# EAGLE design uDJV_board_1_v1.1 (EAGLE 9.3.1)

## Sheet 1 of 2
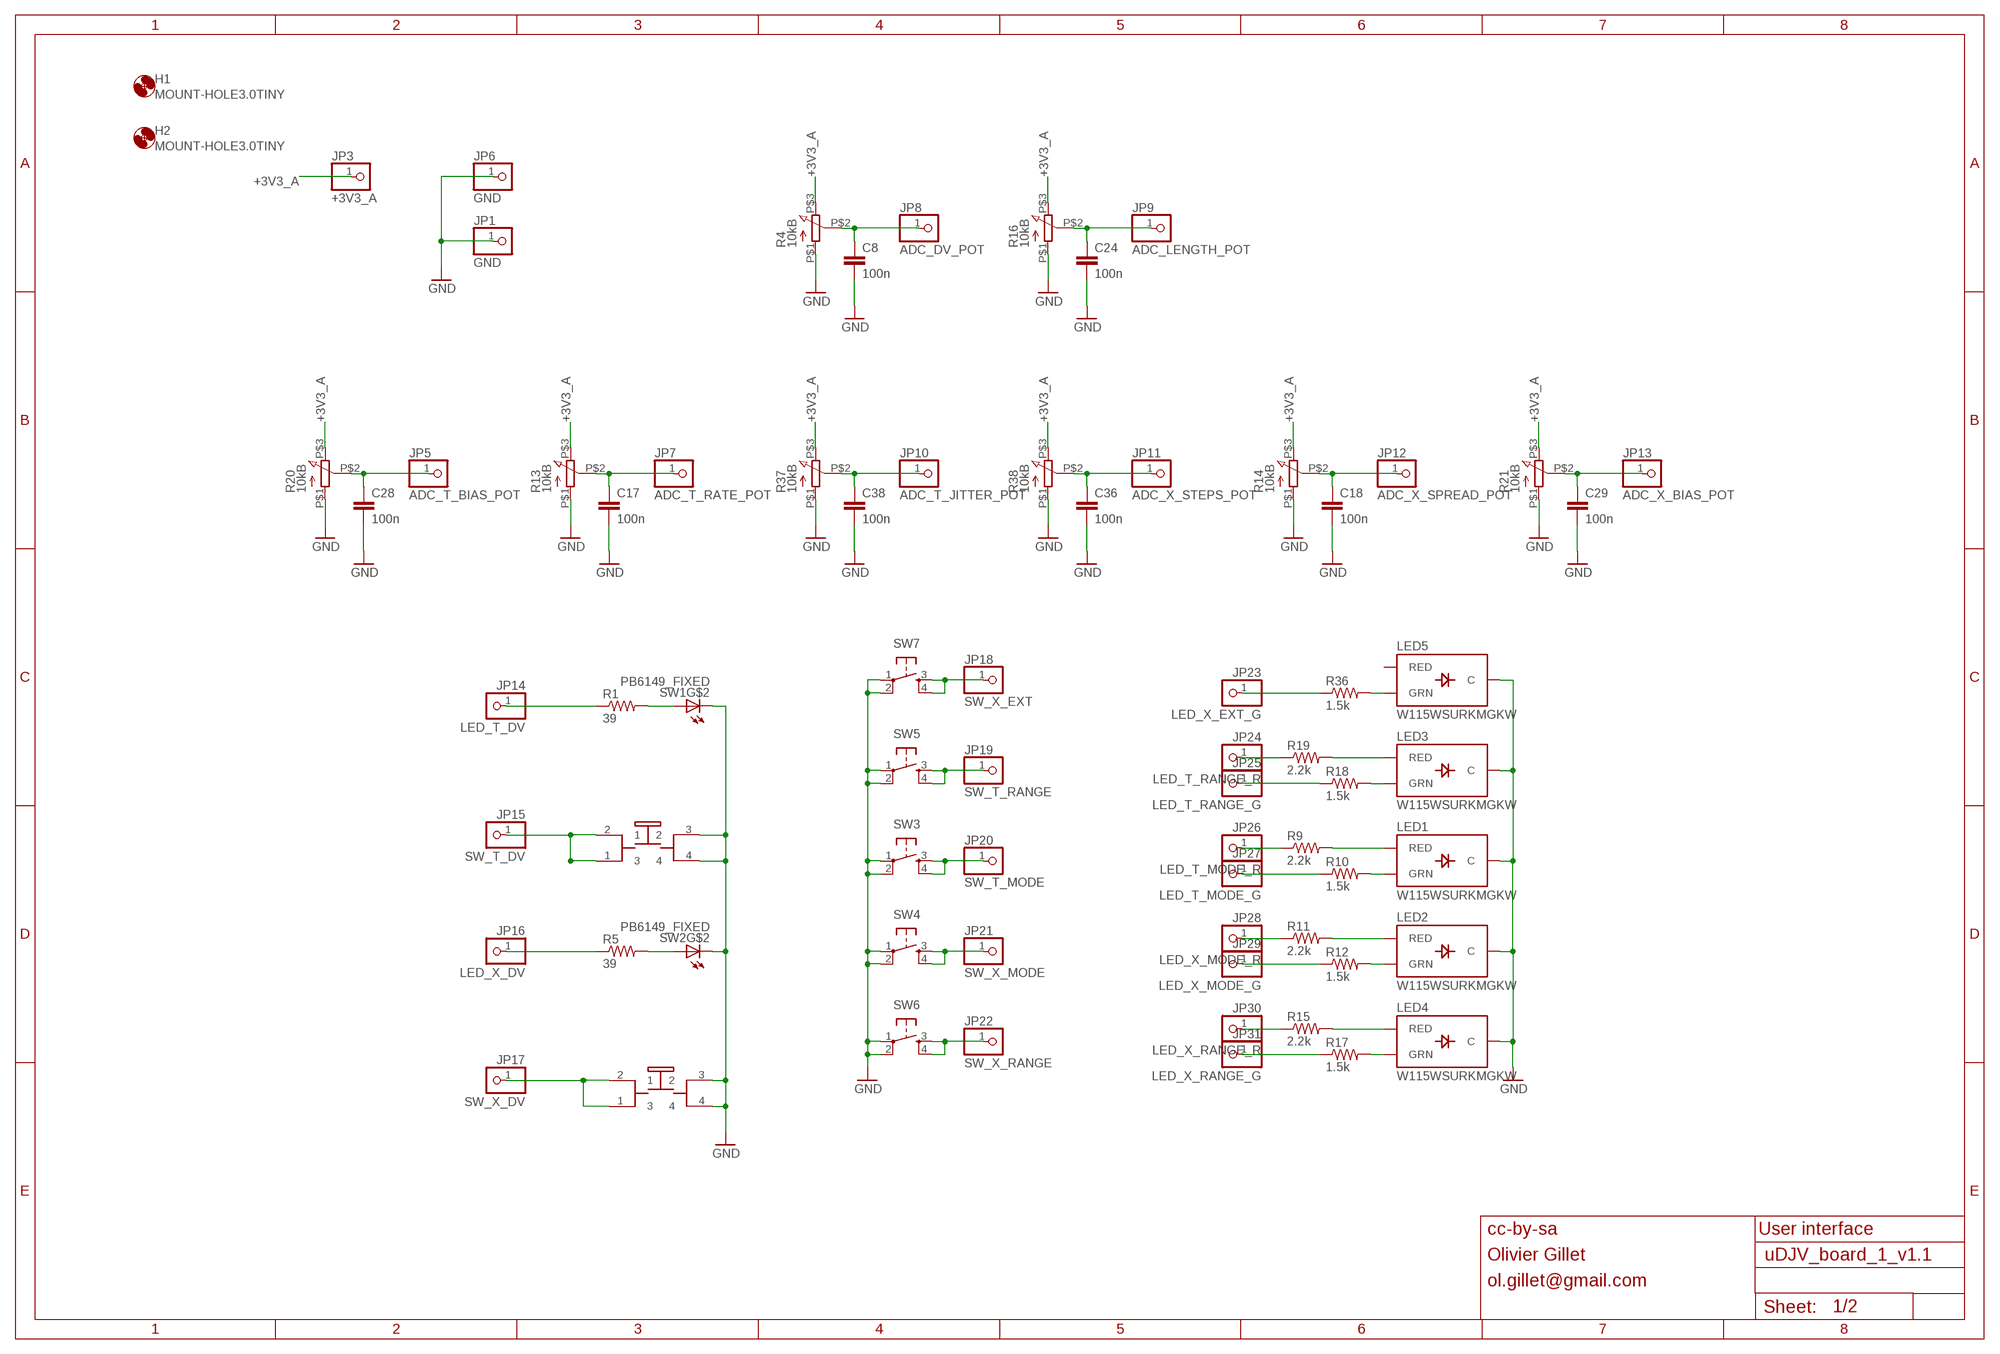
[diagram p0: schematic, sheet 1]

### Parts
C8  100n  PARTS_AMAN_CAPACITOR  [PARTS_AMAN_RESISTOR_0603]
C17  100n  PARTS_AMAN_CAPACITOR  [PARTS_AMAN_RESISTOR_0603]
C18  100n  PARTS_AMAN_CAPACITOR  [PARTS_AMAN_RESISTOR_0603]
C24  100n  PARTS_AMAN_CAPACITOR  [PARTS_AMAN_RESISTOR_0603]
C28  100n  PARTS_AMAN_CAPACITOR  [PARTS_AMAN_RESISTOR_0603]
C29  100n  PARTS_AMAN_CAPACITOR  [PARTS_AMAN_RESISTOR_0603]
C36  100n  PARTS_AMAN_CAPACITOR  [PARTS_AMAN_RESISTOR_0603]
C38  100n  PARTS_AMAN_CAPACITOR  [PARTS_AMAN_RESISTOR_0603]
H1  MOUNT-HOLE3.0TINY  [3,0TINY]
H2  MOUNT-HOLE3.0TINY  [3,0TINY]
JP1  GND  PARTS_AMAN_PINHD-1X1  [PARTS_AMAN_1X01]
JP3  +3V3_A  PARTS_AMAN_PINHD-1X1  [PARTS_AMAN_1X01]
JP5  ADC_T_BIAS_POT  PARTS_AMAN_PINHD-1X1  [PARTS_AMAN_1X01]
JP6  GND  PARTS_AMAN_PINHD-1X1  [PARTS_AMAN_1X01]
JP7  ADC_T_RATE_POT  PARTS_AMAN_PINHD-1X1  [PARTS_AMAN_1X01]
JP8  ADC_DV_POT  PARTS_AMAN_PINHD-1X1  [PARTS_AMAN_1X01]
JP9  ADC_LENGTH_POT  PARTS_AMAN_PINHD-1X1  [PARTS_AMAN_1X01]
JP10  ADC_T_JITTER_POT  PARTS_AMAN_PINHD-1X1  [PARTS_AMAN_1X01]
JP11  ADC_X_STEPS_POT  PARTS_AMAN_PINHD-1X1  [PARTS_AMAN_1X01]
JP12  ADC_X_SPREAD_POT  PARTS_AMAN_PINHD-1X1  [PARTS_AMAN_1X01]
JP13  ADC_X_BIAS_POT  PARTS_AMAN_PINHD-1X1  [PARTS_AMAN_1X01]
JP14  LED_T_DV  PARTS_AMAN_PINHD-1X1  [PARTS_AMAN_1X01]
JP15  SW_T_DV  PARTS_AMAN_PINHD-1X1  [PARTS_AMAN_1X01]
JP16  LED_X_DV  PARTS_AMAN_PINHD-1X1  [PARTS_AMAN_1X01]
JP17  SW_X_DV  PARTS_AMAN_PINHD-1X1  [PARTS_AMAN_1X01]
JP18  SW_X_EXT  PARTS_AMAN_PINHD-1X1  [PARTS_AMAN_1X01]
JP19  SW_T_RANGE  PARTS_AMAN_PINHD-1X1  [PARTS_AMAN_1X01]
JP20  SW_T_MODE  PARTS_AMAN_PINHD-1X1  [PARTS_AMAN_1X01]
JP21  SW_X_MODE  PARTS_AMAN_PINHD-1X1  [PARTS_AMAN_1X01]
JP22  SW_X_RANGE  PARTS_AMAN_PINHD-1X1  [PARTS_AMAN_1X01]
JP23  LED_X_EXT_G  PARTS_AMAN_PINHD-1X1  [PARTS_AMAN_1X01]
JP24  LED_T_RANGE_R  PARTS_AMAN_PINHD-1X1  [PARTS_AMAN_1X01]
JP25  LED_T_RANGE_G  PARTS_AMAN_PINHD-1X1  [PARTS_AMAN_1X01]
JP26  LED_T_MODE_R  PARTS_AMAN_PINHD-1X1  [PARTS_AMAN_1X01]
JP27  LED_T_MODE_G  PARTS_AMAN_PINHD-1X1  [PARTS_AMAN_1X01]
JP28  LED_X_MODE_R  PARTS_AMAN_PINHD-1X1  [PARTS_AMAN_1X01]
JP29  LED_X_MODE_G  PARTS_AMAN_PINHD-1X1  [PARTS_AMAN_1X01]
JP30  LED_X_RANGE_R  PARTS_AMAN_PINHD-1X1  [PARTS_AMAN_1X01]
JP31  LED_X_RANGE_G  PARTS_AMAN_PINHD-1X1  [PARTS_AMAN_1X01]
LED1  W115WSURKMGKW  LED-BICOLOR-THROUGHHOLE2.54  [LED-BICOLOR-THROUGHHOLE-2.54]
LED2  W115WSURKMGKW  LED-BICOLOR-THROUGHHOLE2.54  [LED-BICOLOR-THROUGHHOLE-2.54]
LED3  W115WSURKMGKW  LED-BICOLOR-THROUGHHOLE2.54  [LED-BICOLOR-THROUGHHOLE-2.54]
LED4  W115WSURKMGKW  LED-BICOLOR-THROUGHHOLE2.54  [LED-BICOLOR-THROUGHHOLE-2.54]
LED5  W115WSURKMGKW  LED-BICOLOR-THROUGHHOLE2.54  [LED-BICOLOR-THROUGHHOLE-2.54]
R1  39  PARTS_AMAN_RESISTOR  [PARTS_AMAN_RESISTOR_0603]
R4  10kB  Q-POT2  [Q-POT2]
R5  39  PARTS_AMAN_RESISTOR  [PARTS_AMAN_RESISTOR_0603]
R9  2.2k  PARTS_AMAN_RESISTOR  [PARTS_AMAN_RESISTOR_0603]
R10  1.5k  PARTS_AMAN_RESISTOR  [PARTS_AMAN_RESISTOR_0603]
R11  2.2k  PARTS_AMAN_RESISTOR  [PARTS_AMAN_RESISTOR_0603]
R12  1.5k  PARTS_AMAN_RESISTOR  [PARTS_AMAN_RESISTOR_0603]
R13  10kB  Q-POT2  [Q-POT2]
R14  10kB  Q-POT2  [Q-POT2]
R15  2.2k  PARTS_AMAN_RESISTOR  [PARTS_AMAN_RESISTOR_0603]
R16  10kB  Q-POT2  [Q-POT2]
R17  1.5k  PARTS_AMAN_RESISTOR  [PARTS_AMAN_RESISTOR_0603]
R18  1.5k  PARTS_AMAN_RESISTOR  [PARTS_AMAN_RESISTOR_0603]
R19  2.2k  PARTS_AMAN_RESISTOR  [PARTS_AMAN_RESISTOR_0603]
R20  10kB  Q-POT2  [Q-POT2]
R21  10kB  Q-POT2  [Q-POT2]
R36  1.5k  PARTS_AMAN_RESISTOR  [PARTS_AMAN_RESISTOR_0603]
R37  10kB  Q-POT2  [Q-POT2]
R38  10kB  Q-POT2  [Q-POT2]
SW1  PB6149_FIXED  [PB6149L]
SW2  PB6149_FIXED  [PB6149L]
SW3  TAC_SWITCHPTH  [TACTILE-PTH]
SW4  TAC_SWITCHPTH  [TACTILE-PTH]
SW5  TAC_SWITCHPTH  [TACTILE-PTH]
SW6  TAC_SWITCHPTH  [TACTILE-PTH]
SW7  TAC_SWITCHPTH  [TACTILE-PTH]

### Nets
+3V3_A: JP3.1 R4.P$3 R13.P$3 R14.P$3 R16.P$3 R20.P$3 R21.P$3 R37.P$3 R38.P$3
ADC_DV_POT: C8.1 JP8.1 R4.P$2
ADC_LENGTH_POT: C24.1 JP9.1 R16.P$2
ADC_T_BIAS_POT: C28.1 JP5.1 R20.P$2
ADC_T_JITTER_POT: C38.1 JP10.1 R37.P$2
ADC_T_RATE_POT: C17.1 JP7.1 R13.P$2
ADC_X_BIAS_POT: C29.1 JP13.1 R21.P$2
ADC_X_SPREAD_POT: C18.1 JP12.1 R14.P$2
ADC_X_STEPS_POT: C36.1 JP11.1 R38.P$2
GND: C8.2 C17.2 C18.2 C24.2 C28.2 C29.2 C36.2 C38.2 JP1.1 JP6.1 LED1.2(C) LED2.2(C) LED3.2(C) LED4.2(C) LED5.2(C) R4.P$1 R13.P$1 R14.P$1 R16.P$1 R20.P$1 R21.P$1 R37.P$1 R38.P$1 SW1.3 SW1.4 SW1.K(C) SW2.3 SW2.4 SW2.K(C) SW3.1 SW3.2 SW4.1 SW4.2 SW5.1 SW5.2 SW6.1 SW6.2 SW7.1 SW7.2 ; also sheet 2
LED_T_DV: JP14.1 R1.1
LED_X_DV: JP16.1 R5.1
N$1: R1.2 SW1.A
N$2: R5.2 SW2.A
N$9: LED3.3(RED) R19.2
N$12: LED3.1(GRN) R18.2
N$16: LED1.3(RED) R9.2
N$18: LED2.3(RED) R11.2
N$20: LED2.1(GRN) R12.2
N$21: LED4.3(RED) R15.2
N$22: LED1.1(GRN) R10.2
N$23: LED4.1(GRN) R17.2
N$42: LED5.1(GRN) R36.2
N$43: JP23.1 R36.1
N$55: JP24.1 R19.1
N$66: JP25.1 R18.1
N$69: JP26.1 R9.1
N$79: JP27.1 R10.1
N$80: JP28.1 R11.1
N$81: JP29.1 R12.1
N$82: JP30.1 R15.1
N$83: JP31.1 R17.1
SW_T_DV: JP15.1 SW1.1 SW1.2
SW_T_MODE: JP20.1 SW3.3 SW3.4
SW_T_RANGE: JP19.1 SW5.3 SW5.4
SW_X_DV: JP17.1 SW2.1 SW2.2
SW_X_EXT: JP18.1 SW7.3 SW7.4
SW_X_MODE: JP21.1 SW4.3 SW4.4
SW_X_RANGE: JP22.1 SW6.3 SW6.4
Unconnected: LED5.3(RED)

### Notes on the sheet
- cc-by-sa | User interface
- Olivier Gillet
- ol.gillet@gmail.com

## Sheet 2 of 2
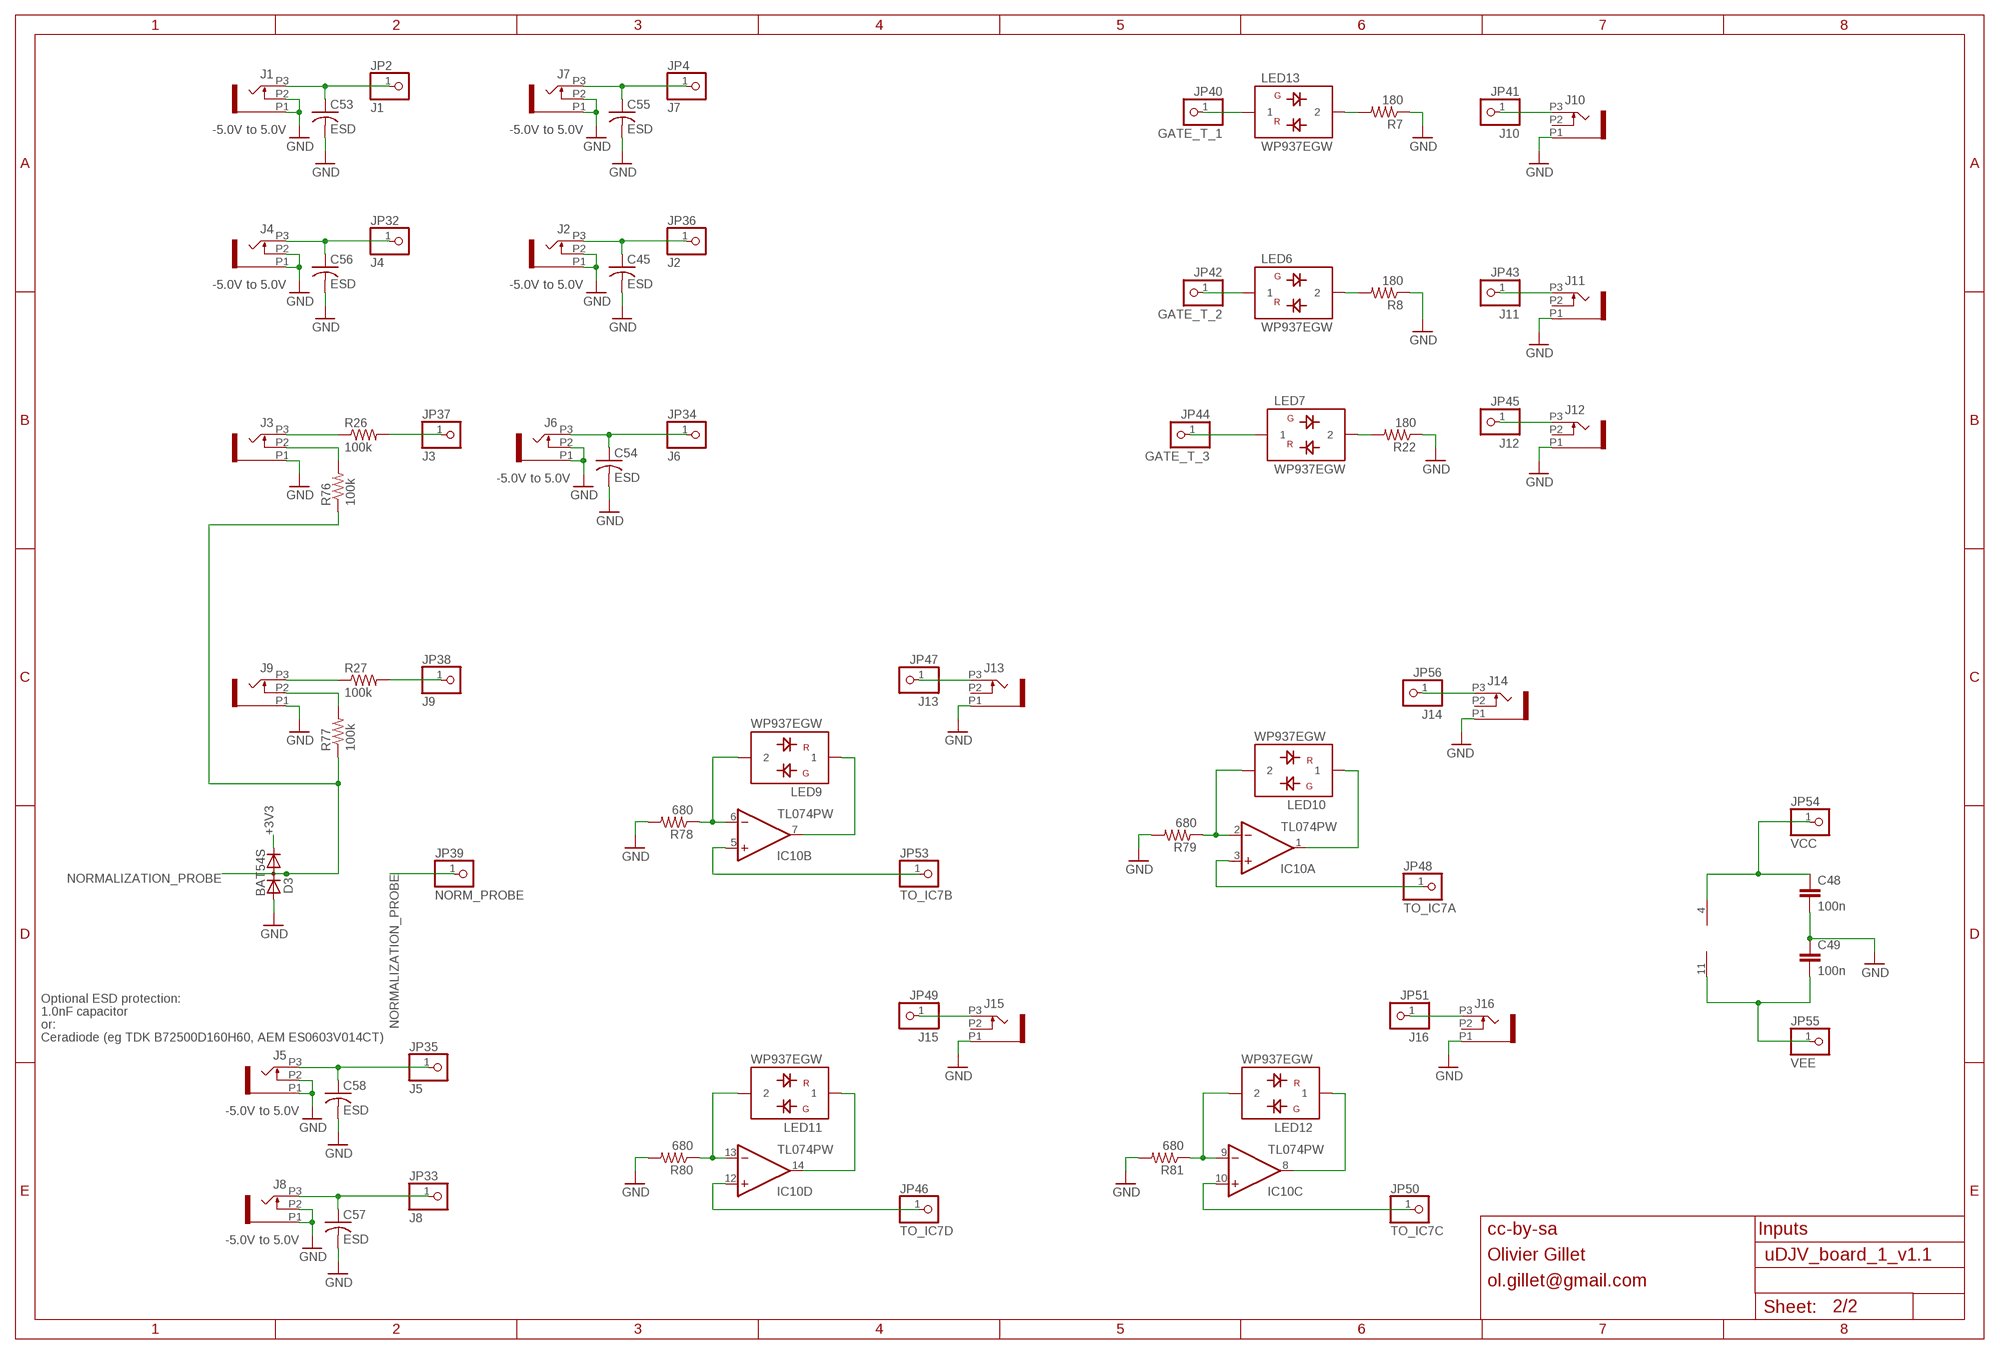
[diagram p1: schematic, sheet 2]

### Parts
C45  ESD  C-USC0603  [C0603]
C48  100n  PARTS_AMAN_CAPACITOR  [PARTS_AMAN_RESISTOR_0603]
C49  100n  PARTS_AMAN_CAPACITOR  [PARTS_AMAN_RESISTOR_0603]
C53  ESD  C-USC0603  [C0603]
C54  ESD  C-USC0603  [C0603]
C55  ESD  C-USC0603  [C0603]
C56  ESD  C-USC0603  [C0603]
C57  ESD  C-USC0603  [C0603]
C58  ESD  C-USC0603  [C0603]
D3  BAT54S  DIODE_2CACA-SOT23  [SOT23]
IC10  TL074PW  [TSSOP14_065]
J1  PJ301_THONKICONN6  [WQP_PJ_301M6]
J2  PJ301_THONKICONN6  [WQP_PJ_301M6]
J3  PJ301_THONKICONN6  [WQP_PJ_301M6]
J4  PJ301_THONKICONN6  [WQP_PJ_301M6]
J5  PJ301_THONKICONN6  [WQP_PJ_301M6]
J6  PJ301_THONKICONN6  [WQP_PJ_301M6]
J7  PJ301_THONKICONN6  [WQP_PJ_301M6]
J8  PJ301_THONKICONN6  [WQP_PJ_301M6]
J9  PJ301_THONKICONN6  [WQP_PJ_301M6]
J10  PJ301_THONKICONN6  [WQP_PJ_301M6]
J11  PJ301_THONKICONN6  [WQP_PJ_301M6]
J12  PJ301_THONKICONN6  [WQP_PJ_301M6]
J13  PJ301_THONKICONN6  [WQP_PJ_301M6]
J14  PJ301_THONKICONN6  [WQP_PJ_301M6]
J15  PJ301_THONKICONN6  [WQP_PJ_301M6]
J16  PJ301_THONKICONN6  [WQP_PJ_301M6]
JP2  J1  PARTS_AMAN_PINHD-1X1  [PARTS_AMAN_1X01]
JP4  J7  PARTS_AMAN_PINHD-1X1  [PARTS_AMAN_1X01]
JP32  J4  PARTS_AMAN_PINHD-1X1  [PARTS_AMAN_1X01]
JP33  J8  PARTS_AMAN_PINHD-1X1  [PARTS_AMAN_1X01]
JP34  J6  PARTS_AMAN_PINHD-1X1  [PARTS_AMAN_1X01]
JP35  J5  PARTS_AMAN_PINHD-1X1  [PARTS_AMAN_1X01]
JP36  J2  PARTS_AMAN_PINHD-1X1  [PARTS_AMAN_1X01]
JP37  J3  PARTS_AMAN_PINHD-1X1  [PARTS_AMAN_1X01]
JP38  J9  PARTS_AMAN_PINHD-1X1  [PARTS_AMAN_1X01]
JP39  NORM_PROBE  PARTS_AMAN_PINHD-1X1  [PARTS_AMAN_1X01]
JP40  GATE_T_1  PARTS_AMAN_PINHD-1X1  [PARTS_AMAN_1X01]
JP41  J10  PARTS_AMAN_PINHD-1X1  [PARTS_AMAN_1X01]
JP42  GATE_T_2  PARTS_AMAN_PINHD-1X1  [PARTS_AMAN_1X01]
JP43  J11  PARTS_AMAN_PINHD-1X1  [PARTS_AMAN_1X01]
JP44  GATE_T_3  PARTS_AMAN_PINHD-1X1  [PARTS_AMAN_1X01]
JP45  J12  PARTS_AMAN_PINHD-1X1  [PARTS_AMAN_1X01]
JP46  TO_IC7D  PARTS_AMAN_PINHD-1X1  [PARTS_AMAN_1X01]
JP47  J13  PARTS_AMAN_PINHD-1X1  [PARTS_AMAN_1X01]
JP48  TO_IC7A  PARTS_AMAN_PINHD-1X1  [PARTS_AMAN_1X01]
JP49  J15  PARTS_AMAN_PINHD-1X1  [PARTS_AMAN_1X01]
JP50  TO_IC7C  PARTS_AMAN_PINHD-1X1  [PARTS_AMAN_1X01]
JP51  J16  PARTS_AMAN_PINHD-1X1  [PARTS_AMAN_1X01]
JP53  TO_IC7B  PARTS_AMAN_PINHD-1X1  [PARTS_AMAN_1X01]
JP54  VCC  PARTS_AMAN_PINHD-1X1  [PARTS_AMAN_1X01]
JP55  VEE  PARTS_AMAN_PINHD-1X1  [PARTS_AMAN_1X01]
JP56  J14  PARTS_AMAN_PINHD-1X1  [PARTS_AMAN_1X01]
LED6  WP937EGW  LED-BICOLOR-SHARED-THROUGHHOLE  [LED3MM]
LED7  WP937EGW  LED-BICOLOR-SHARED-THROUGHHOLE  [LED3MM]
LED9  WP937EGW  LED-BICOLOR-SHARED-THROUGHHOLE  [LED3MM]
LED10  WP937EGW  LED-BICOLOR-SHARED-THROUGHHOLE  [LED3MM]
LED11  WP937EGW  LED-BICOLOR-SHARED-THROUGHHOLE  [LED3MM]
LED12  WP937EGW  LED-BICOLOR-SHARED-THROUGHHOLE  [LED3MM]
LED13  WP937EGW  LED-BICOLOR-SHARED-THROUGHHOLE  [LED3MM]
R7  180  PARTS_AMAN_RESISTOR  [PARTS_AMAN_RESISTOR_0603]
R8  180  PARTS_AMAN_RESISTOR  [PARTS_AMAN_RESISTOR_0603]
R22  180  PARTS_AMAN_RESISTOR  [PARTS_AMAN_RESISTOR_0603]
R26  100k  PARTS_AMAN_RESISTOR  [PARTS_AMAN_RESISTOR_0603]
R27  100k  PARTS_AMAN_RESISTOR  [PARTS_AMAN_RESISTOR_0603]
R76  100k  PARTS_AMAN_RESISTOR  [PARTS_AMAN_RESISTOR_0603]
R77  100k  PARTS_AMAN_RESISTOR  [PARTS_AMAN_RESISTOR_0603]
R78  680  PARTS_AMAN_RESISTOR  [PARTS_AMAN_RESISTOR_0603]
R79  680  PARTS_AMAN_RESISTOR  [PARTS_AMAN_RESISTOR_0603]
R80  680  PARTS_AMAN_RESISTOR  [PARTS_AMAN_RESISTOR_0603]
R81  680  PARTS_AMAN_RESISTOR  [PARTS_AMAN_RESISTOR_0603]

### Nets
+3V3: D3.2(C)
GATE_T_2: JP42.1 LED6.1
GND: C45.2 C48.2 C49.1 C53.2 C54.2 C55.2 C56.2 C57.2 C58.2 D3.1(A) J1.P1 J1.P2 J2.P1 J2.P2 J3.P1 J4.P1 J4.P2 J5.P1 J5.P2 J6.P1 J6.P2 J7.P1 J7.P2 J8.P1 J8.P2 J9.P1 J10.P1 J11.P1 J12.P1 J13.P1 J14.P1 J15.P1 J16.P1 R7.1 R8.1 R22.1 R78.2 R79.2 R80.2 R81.2 ; also sheet 1
MORPH_IN: C53.1 J1.P3 JP2.1
MORPH_IN1: C55.1 J7.P3 JP4.1
MORPH_IN3: C56.1 J4.P3 JP32.1
MORPH_IN4: C57.1 J8.P3 JP33.1
MORPH_IN5: C54.1 J6.P3 JP34.1
MORPH_IN6: C58.1 J5.P3 JP35.1
MORPH_IN7: C45.1 J2.P3 JP36.1
N$3: C49.2 IC10.11(P:V-) JP55.1
N$4: JP37.1 R26.2
N$5: JP38.1 R27.2
N$6: JP40.1 LED13.1
N$7: J10.P3 JP41.1
N$8: J12.P3 JP45.1
N$10: LED13.2 R7.2
N$11: J11.P3 JP43.1
N$13: J16.P3 JP51.1
N$14: LED6.2 R8.2
N$15: LED7.2 R22.2
N$19: JP44.1 LED7.1
N$24: C48.1 IC10.4(P:V+) JP54.1
N$36: J9.P3 R27.1
N$45: IC10.5(B:+IN) JP53.1
N$46: J9.P2 R77.2
N$47: J3.P2 R76.2
N$49: J15.P3 JP49.1
N$53: J13.P3 JP47.1
N$57: J3.P3 R26.1
N$63: J14.P3 JP56.1
N$67: IC10.6(B:-IN) LED9.2 R78.1
N$68: IC10.7(B:OUT) LED9.1
N$70: IC10.3(A:+IN) JP48.1
N$71: IC10.2(A:-IN) LED10.2 R79.1
N$72: IC10.1(A:OUT) LED10.1
N$73: IC10.12(D:+IN) JP46.1
N$74: IC10.13(D:-IN) LED11.2 R80.1
N$75: IC10.14(D:OUT) LED11.1
N$76: IC10.10(C:+IN) JP50.1
N$77: IC10.9(C:-IN) LED12.2 R81.1
N$78: IC10.8(C:OUT) LED12.1
NORMALIZATION_PROBE: D3.3(AC) JP39.1 R76.1 R77.1
Unconnected: J10.P2 J11.P2 J12.P2 J13.P2 J14.P2 J15.P2 J16.P2

### Notes on the sheet
- -5.0V to 5.0V | -5.0V to 5.0V
- -5.0V to 5.0V | -5.0V to 5.0V
- -5.0V to 5.0V
- Optional ESD protection:
- 1.0nF capacitor
- or:
- Ceradiode (eg TDK B72500D160H60, AEM ES0603V014CT)
- -5.0V to 5.0V
- -5.0V to 5.0V | cc-by-sa | Inputs
- Olivier Gillet
- ol.gillet@gmail.com

## Library data of the parts
C8 C17 C18 C24 C28 C29 C36 C38 C48 C49 = atom_v1_1_board_2:PARTS_AMAN_CAPACITOR
C45 C53-C58 = rcl:C-US: CAPACITOR, American symbol
D3 = diode:DIODE_2CACA-: 2 Diodes - Cathode-Anode|Cathode-Anode
H1 H2 = og-holes:MOUNT-HOLE: MOUNTING HOLE with drill center marker
IC10 = og-linear:TL074: OP AMP
J1-J16 = og-pj301:PJ301_THONKICONN
JP1-JP51 JP53-JP56 = atom_v1_1_board_2:PARTS_AMAN_PINHD-1X1: PIN HEADER
LED1-LED5 = og-leds:LED-BICOLOR-THROUGHHOLE
LED6 LED7 LED9-LED13 = og-leds:LED-BICOLOR-SHARED-THROUGHHOLE
R1 R5 R7-R12 R15 R17-R19 R22 R26 R27 R36 R76-R81 = atom_v1_1_board_2:PARTS_AMAN_RESISTOR
R4 R13 R14 R16 R20 R21 R37 R38 = uClouds_002:Q-POT2
SW1 SW2 = uClouds_002:PB6149_FIXED
SW3-SW7 = SparkFun:TAC_SWITCH: Momentary Switch Button commonly used for reset or general input. Spark Fun Electronics SKU : COM-00097

## Board
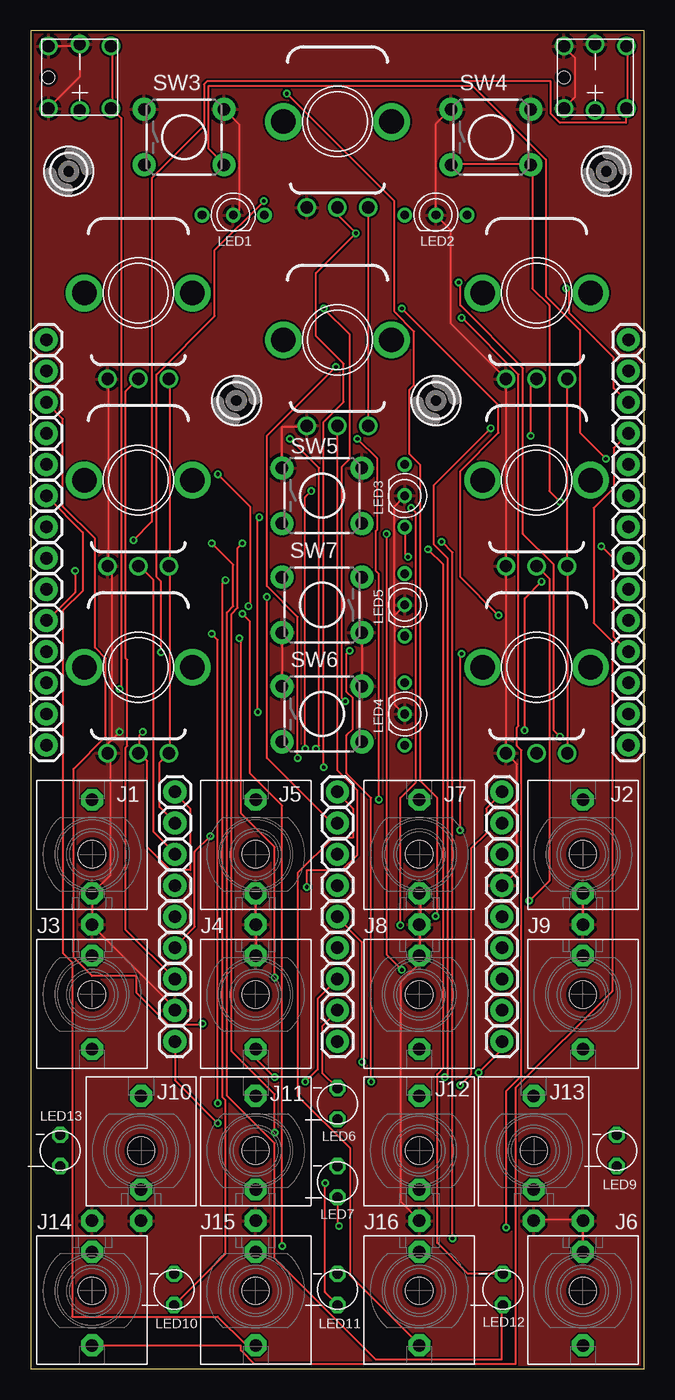
[diagram p2: board, top side]
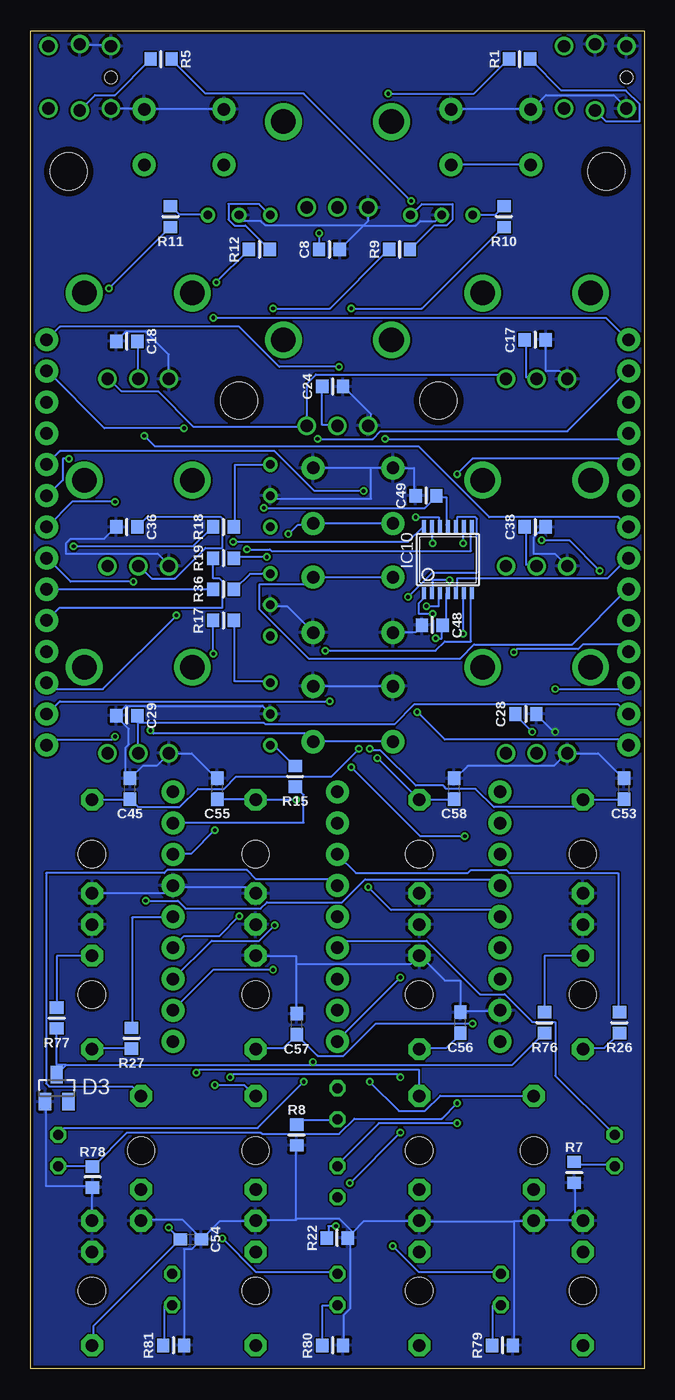
[diagram p3: board, bottom side, seen from below]

Size 50 x 109 mm. Coordinates in mm from the lower left corner, seen from the top.
Outline: 0,0 50,0 50,109 0,109 0,0
Copper layers (1*16): Top 0.035mm / dielectric 1.5mm / Bottom 0.035mm
Design rules "dirt_cheap_dirty_boards.v1.1": minimum track width 6mil, minimum drill 12mil, track to track 6mil, track to pad 6mil, pad to pad 6mil, via to via 6mil, smd to smd 0mil, copper to edge 10mil, drill to drill 10mil, minimum pad ring 10mil, minimum via ring 6mil, stop-mask expansion 2mil, vias tented up to drill 25mil, thermal gap 10mil

### Footprints (pad centres in the part's own frame; a part is rotated, then mirrored left to right if it is on the bottom)
PARTS_AMAN_RESISTOR_0603 = smd 1 x 1.1: 1 -0.85,0; 2 0.85,0
C0603 = smd 1.1 x 1: 1 -0.85,0; 2 0.85,0
SOT23 = smd 1 x 1.4: 1 -0.95,-1.1; 2 0.95,-1.1; 3 0,1.1
3,0TINY = hole 3: 0,0
TSSOP14_065 = smd 0.305 x 0.991: 1 -1.95,-2.718; 2 -1.3,-2.718; 3 -0.65,-2.718; 4 0,-2.718; 5 0.65,-2.718; 6 1.3,-2.718; 7 1.95,-2.718; 8 1.95,2.718; 9 1.3,2.718; 10 0.65,2.718; 11 0,2.718; 12 -0.65,2.718; 13 -1.3,2.718; 14 -1.95,2.718
WQP_PJ_301M6 = drill 1.016 pad 1.778 octagon: P1 0,-5.715; P2 0,-3.175; P3 0,4.445 | hole 2.2: 0,0
PARTS_AMAN_1X01 = drill 1.016 pad 1.88: 1 0,0
LED-BICOLOR-THROUGHHOLE-2.54 = drill 0.7: 1 -2.54,0; 2 0,0; 3 2.54,0
LED3MM = drill 0.813 octagon: 1 -1.27,0; 2 1.27,0
Q-POT2 = drill 1 pad 1.5: P$1 -2.5,-7; P$2 0,-7; P$3 2.5,-7 | drill 2 pad 2.5: P$4 -4.4,0; P$5 4.4,0
PB6149L = drill 1: 1 2.54,-2.54; 2 2.54,2.54; 3 -2.54,-2.54; 4 -2.54,2.54; A 0,-2.7; K 0,2.7 | hole 1: -2.54,0
TACTILE-PTH = drill 1.016 pad 1.88: 1 -3.251,2.261; 2 3.251,2.261; 3 -3.251,-2.261; 4 3.251,-2.261

### Placement (x,y rotation side)
C8  25.65,91.19 0 bottom
C17  8.89,83.82 0 bottom
C18  42.16,83.69 180 bottom
C24  25.4,80.01 0 bottom
C28  9.65,53.34 0 bottom
C29  42.16,53.21 180 bottom
C36  42.16,68.58 180 bottom
C38  8.89,68.58 0 bottom
C45  41.91,47.24 90 bottom
C48  17.27,60.58 180 bottom
C49  17.78,71.12 0 bottom
C53  1.65,47.24 90 bottom
C54  36.96,10.54 0 bottom
C55  34.8,47.24 90 bottom
C56  14.99,28.19 90 bottom
C57  28.32,28.07 90 bottom
C58  15.49,47.24 90 bottom
D3  47.88,22.86 0 bottom
H1  16.76,78.87 0 top
H2  33.02,78.87 0 top
H3  MOUNT-HOLE3.0TINY  [3,0TINY]  3.1,97.54 0 top
H4  MOUNT-HOLE3.0TINY  [3,0TINY]  46.9,97.54 0 top
IC10  16,65.91 0 bottom
J1  5,41.91 0 top
J2  45,41.91 0 top
J3  5,30.48 180 top
J4  18.33,30.48 180 top
J5  18.33,41.91 0 top
J6  45,6.35 180 top
J7  31.67,41.91 0 top
J8  31.67,30.48 180 top
J9  45,30.48 180 top
J10  9,17.78 0 top
J11  18.33,17.78 0 top
J12  31.67,17.78 0 top
J13  41,17.78 0 top
J14  5,6.35 180 top
J15  18.33,6.35 180 top
J16  31.67,6.35 180 top
JP1  38.4,39.37 0 top
JP2  48.7,73.66 0 top
JP3  11.75,44.45 0 top
JP4  1.27,81.28 0 top
JP5  11.75,46.99 0 top
JP6  11.75,29.21 0 top
JP7  11.75,31.75 0 top
JP8  11.75,34.29 0 top
JP9  11.75,36.83 0 top
JP10  11.75,41.91 0 top
JP11  11.75,39.37 0 top
JP12  1.27,68.58 0 top
JP13  1.27,53.34 0 top
JP14  38.4,34.29 0 top
JP15  1.27,55.88 0 top
JP16  1.27,58.42 0 top
JP17  1.27,60.96 0 top
JP18  1.27,63.5 0 top
JP19  38.4,29.21 0 top
JP20  48.7,71.12 0 top
JP21  48.7,68.58 0 top
JP22  48.7,66.04 0 top
JP23  48.7,63.5 0 top
JP24  48.7,60.96 0 top
JP25  48.7,58.42 0 top
JP26  48.7,55.88 0 top
JP27  48.7,53.34 0 top
JP28  48.7,78.74 0 top
JP29  48.7,50.8 0 top
JP30  38.4,44.45 0 top
JP31  38.4,41.91 0 top
JP32  48.7,81.28 0 top
JP33  1.27,78.74 0 top
JP34  1.27,83.82 0 top
JP35  48.7,83.82 0 top
JP36  1.27,76.2 0 top
JP37  25,41.91 0 top
JP38  38.4,36.83 0 top
JP39  25,36.83 0 top
JP40  25,34.29 0 top
JP41  25,31.75 0 top
JP42  25,29.21 0 top
JP43  38.4,26.67 0 top
JP44  11.75,26.67 0 top
JP45  38.4,46.99 0 top
JP46  1.27,50.8 0 top
JP47  25,39.37 0 top
JP48  1.27,73.66 0 top
JP49  1.27,71.12 0 top
JP50  25,44.45 0 top
JP51  25,46.99 0 top
JP53  1.27,66.04 0 top
JP54  25,26.67 0 top
JP55  38.4,31.75 0 top
JP56  48.7,76.2 0 top
LED1  16.51,93.98 0 top
LED2  33.02,93.98 0 top
LED3  30.48,71.12 270 top
LED4  30.48,53.34 270 top
LED5  30.48,62.23 270 top
LED6  25,21.59 270 top
LED7  25,15.24 270 top
LED9  47.75,17.78 270 top
LED10  11.68,6.46 270 top
LED11  25,6.46 270 top
LED12  38.48,6.46 270 top
LED13  2.41,17.78 270 top
R1  10.16,106.68 0 bottom
R4  25,101.6 0 top
R5  39.37,106.68 180 bottom
R7  5.71,16 90 bottom
R8  28.32,19.05 90 bottom
R9  19.94,91.19 0 bottom
R10  11.43,93.85 90 bottom
R11  38.61,93.85 90 bottom
R12  31.37,91.19 0 bottom
R13  8.77,87.63 0 top
R14  41.23,87.63 0 top
R15  28.45,48.26 90 bottom
R16  25,83.82 0 top
R17  34.29,60.96 0 bottom
R18  34.29,68.58 0 bottom
R19  34.29,66.04 0 bottom
R20  8.77,57.15 0 top
R21  41.23,57.15 0 top
R22  25.02,10.67 180 bottom
R26  2.03,28.19 90 bottom
R27  41.78,26.92 90 bottom
R36  34.29,63.5 0 bottom
R37  8.77,72.39 0 top
R38  41.23,72.39 0 top
R76  8.13,28.19 90 bottom
R77  47.88,28.57 90 bottom
R78  44.96,15.62 270 bottom
R79  11.56,1.91 0 bottom
R80  25.4,1.91 0 bottom
R81  38.35,1.91 0 bottom
SW1  4,105.2 0 top
SW2  46,105.2 0 top
SW3  12.5,100.33 0 top
SW4  37.5,100.33 0 top
SW5  23.73,71.12 0 top
SW6  23.73,53.34 0 top
SW7  23.73,62.23 180 top

### Tracks (layer width: path | path; a pad name or v marks a point on that pad's centre or on a via)
+3V3_A
  Top 0.152: JP3.1 11.75,44.5 10.5,45.75 10.5,49.38 11.25,50.12 R20.P$3 11.38,50.25 11.38,65.38 R37.P$3 11.38,65.5 11.38,80.62 R13.P$3 | R4.P$3 R16.P$3 | R21.P$3 43.75,50.25 43.75,65.38 R38.P$3 43.75,65.5 43.75,80.62 R14.P$3
  Bottom 0.152: R14.P$3 43.62,80.62 42.62,79.62 39.62,79.62 36.75,76.75 27.5,76.75 R16.P$3 27.5,80.25 26.75,81 11.62,81 11.38,80.75 R13.P$3
ADC_DV_POT  (via drill 0.3)
  Top 0.152: R4.P$2 25,94 v26.5,92.5 23.25,89.25 23.25,84.12 25.5,81.88 25.5,78.75 23.88,77.12 v23.88,49 | v14.62,43.38 13.38,42.12 13.38,36 11.75,34.38 JP8.1
  Bottom 0.152: v26.5,92.5 26.5,91.25 C8.1 | v23.88,49 18.25,43.38 v14.62,43.38
ADC_LENGTH_POT  (via drill 0.3)
  Top 0.152: R16.P$2 25,48.75 26.62,47.12 26.62,41.88 25.38,40.62 22.5,40.62 v22.5,39.25
  Bottom 0.152: C24.1 26.25,76.88 25,76.88 R16.P$2 | v22.5,39.25 20.62,37.38 12.25,37.38 11.75,36.88 JP9.1
ADC_T_BIAS_POT  (via drill 0.3)
  Top 0.152: v9.12,51.88 8.88,51.62 8.88,50.25 R20.P$2 8.88,50.12 9.5,49.5 9.5,42.5 11.38,40.62 13,40.62 13,45.62 11.75,46.88 JP5.1
  Bottom 0.152: v9.12,51.88 10.5,53.25 C28.1
ADC_T_JITTER_POT
  Top 0.152: R37.P$2 8.88,65.38 10,64.25 10,43.75 11.75,42 JP10.1
  Bottom 0.152: C38.1 9.62,68.5 9.62,65.5 8.88,65.5 R37.P$2
ADC_T_RATE_POT
  Top 0.152: JP7.1 7.75,35.75 7.75,50.62 7.88,50.75 7.88,57.75 7.75,57.88 7.75,79.62 8.75,80.62 R13.P$2
  Bottom 0.152: C17.1 9.62,83.75 9.62,80.75 8.88,80.75 R13.P$2
ADC_X_BIAS_POT
  Bottom 0.152: 41.25,52.62 41.25,50.25 R21.P$2 | 41.25,52.62 41.25,53.12 C29.1 | 41.25,52.62 31,52.62 30.88,52.5 20.38,52.5 18.75,54.12 2.12,54.12 1.38,53.38 JP13.1
ADC_X_SPREAD_POT  (via drill 0.3)
  Top 0.152: v40.75,76 40.75,80.25 41.12,80.62 R14.P$2
  Bottom 0.152: C18.1 41.25,83.62 41.25,80.75 R14.P$2 | v40.75,76 39.88,75.12 18.38,75.12 12.62,69.38 2.12,69.38 1.38,68.62 JP12.1
ADC_X_STEPS_POT  (via drill 0.3)
  Top 0.152: v40.62,38.12 42.25,39.75 42.25,64.38 41.25,65.38 R38.P$2
  Bottom 0.152: C36.1 41.25,68.62 40.5,69.38 34.5,69.38 34.38,69.25 34.38,66.88 35.75,66.88 38.25,64.38 40.12,64.38 41.12,65.38 R38.P$2 | v40.62,38.12 38,38.12 37.38,37.5 31.25,37.5 30.75,38 24.62,38 22.75,39.88 12.25,39.88 JP11.1
GATE_T_2
  Top 0.152: LED6.1 25,22.88 23.75,24.12 23.75,27.88 25,29.12 JP42.1
GND  (via drill 0.3)
  Top 0.152: R13.P$1 6.38,80.62 6.38,65.5 R37.P$1 6.38,65.38 6.62,65.12 6.62,51.25 | 6.62,51.25 6.38,51 6.38,50.25 R20.P$1 6.38,50.12 6.5,50 6.5,40.25 5,38.75 J1.P2 5,36.25 J3.P1 5,36.12 11.75,29.38 JP6.1 | 6.62,51.25 v7.25,51.88 | J4.P2 18.38,33.75 18.38,36.12 J4.P1 18.38,36.25 18.38,38.62 J5.P2 | J13.P1 41,12.12 44.88,12.12 J6.P1 45,12 45,9.62 J6.P2 | 18.38,12.12 J15.P1 | 31.75,12.12 J16.P1 31.62,12.12 30.12,13.62 30.12,31.5 31.62,33 31.62,33.62 J8.P2 31.75,33.75 31.75,36.12 J8.P1 31.75,36.25 31.75,38.62 J7.P2 | SW4.1 34.12,102.5 33,101.38 33,94 LED2.2 34.25,92.75 34.25,85.12 38.62,80.75 R14.P$1 38.75,80.62 38.75,65.5 R38.P$1 38.75,65.38 38.75,50.25 R21.P$1 38.75,50.12 39.62,49.25 39.62,40.5 38.5,39.38 JP1.1 | SW2.4 43.5,107.62 44.38,106.75 44.38,103.62 43.5,102.75 SW2.3 | 4,107.75 SW1.K 4,107.88 | 4,107.75 4,105.25 1.5,102.75 SW1.3 | 4,107.75 1.5,107.75 SW1.4 | LED1.2 16.62,94 17,94.38 17,101.38 15.88,102.5 SW3.2 | R16.P$1 22.5,76.75 20.5,76.75 20.5,73.5 SW5.1 | SW6.1 20.5,55.62 20.5,59.88 SW7.2 | SW6.2 27,55.62 27,59.88 SW7.1 | 29.62,61.38 29.62,54.12 30.38,53.38 LED4.2 | LED5.2 29.62,61.38 | 29.62,61.38 29.62,70.25 30.38,71 LED3.2 | J9.P1 45,36.25 45,38.62 J2.P2
  Bottom 0.152: C17.2 8,83.75 8,81.25 6.88,81.25 6.38,80.75 R13.P$1 | C38.2 8.12,68.5 8.5,68.12 8.62,68.12 9,67.75 9,66.38 7.25,66.38 6.38,65.5 R37.P$1 | C53.2 1.75,48.12 3.75,50.12 6.25,50.12 R20.P$1 6.38,50.12 7.38,49.12 14.38,49.12 15.38,48.12 C58.2 | v7.25,51.88 7.38,51.88 8.75,53.25 C28.2 | JP6.1 11.75,29.12 14.88,29.12 C56.2 15,29.12 15,31.62 16.25,31.62 18.25,33.62 J4.P2 18.38,33.62 19,33 28.38,33 | J6.P1 45,12.12 45,14.75 R78.2 45,14.88 48.75,14.88 48.75,21.75 D3.1 | 5.62,12.12 5.62,15.12 R7.1 | 5.62,12.12 5,12.12 J14.P1 5.62,12.12 | 10.62,12 10.62,2 R79.2 | 10.62,12 9,12 J10.P1 9,12.12 5.62,12.12 | 23.75,11.12 22.88,12 18.38,12 J15.P1 18.25,12 10.62,12 | 23.75,11.12 24.12,10.75 R22.1 | R80.2 24.5,2 24.5,4.38 24,4.88 24,10.62 24.12,10.62 R22.1 | 28.38,12.25 28.38,12.12 31.62,12.12 J16.P1 31.75,12 34.62,12 36,10.62 C54.2 | 28.38,12.25 28.38,18.12 R8.1 | R81.2 37.5,2 37.5,9.75 36.88,9.75 36.12,10.5 C54.2 | 23.75,11.12 24.88,12.25 28.38,12.25 | 23.75,11.12 R22.1 | J13.P1 41,12.12 37.62,12.12 36.12,10.62 C54.2 | SW2.4 43.5,107.75 43.62,107.88 46,107.88 SW2.K | SW2.3 43.38,102.62 40.88,102.62 SW4.2 40.75,102.62 34.25,102.62 SW4.1 | 22.88,93.12 22.5,93.5 R4.P$1 | 22.88,93.12 24.75,91.25 C8.2 | 22.88,93.12 18.62,93.12 18.25,93.5 17,93.5 16.62,93.88 LED1.2 | SW3.2 15.75,102.62 9.25,102.62 SW3.1 9.12,102.62 8,103.75 2.5,103.75 1.5,102.75 SW1.3 | 22.88,93.12 30.88,93.12 31.25,93.5 32.62,93.5 33,93.88 LED2.2 | C24.2 24.5,80 22.25,77.75 22.25,76.88 22.5,76.88 R16.P$1 | C49.1 18.75,71.12 18.75,73.38 20.38,73.38 SW5.1 20.5,73.38 22.25,73.38 | 22.25,73.38 26.88,73.38 SW5.2 | C48.2 18.12,60.5 18.62,60 20.38,60 SW7.2
  Bottom 0.152: SW7.1 27,60 29.12,62.12 30.38,62.12 LED5.2 | SW6.1 20.5,55.62 26.88,55.62 SW6.2 | 22.25,73.38 22.25,70.88 30.25,70.88 30.38,71 LED3.2 | C18.2 43,83.75 42.25,84.5 40.62,84.5 38.75,82.62 38.75,80.75 R14.P$1 | C36.2 43.12,68.5 44,67.62 46.75,67.62 47.12,67.25 47.12,66.38 39.62,66.38 38.75,65.5 R38.P$1 | 28.38,33 28.38,33.62 31.62,33.62 J8.P2 | 28.38,33 28.38,29 C57.2 | C55.2 34.88,48.12 36.88,50.12 38.62,50.12 R21.P$1 38.75,50.12 39.75,49.12 40.88,49.12 41.88,48.12 C45.2 42,48.12 42.25,48.12 42.25,50.62 42,50.88 42,52.12 43,53.12 C29.2 43,53.25 42.25,54 31.12,54 30.5,53.38 LED4.2 | J2.P2 44.88,38.75 39,38.75 38.5,39.25 JP1.1 38.38,39.25 32.25,39.25 31.75,38.75 J7.P2
  pour Top (isolate 0.012): 0,108.97 50.04,108.97 50.04,0 0,0
  pour Bottom (isolate 0.012): 0,108.97 50.04,108.97 50.04,0 0,0
LED_T_DV  (via drill 0.3)
  Top 0.152: v20.88,103.88 29.62,95.12 29.62,86.12 31.25,84.5 31.25,80.12 30.88,79.75 30.88,74.5 31.75,73.62 31.75,47.88 33.12,46.5 33.12,37 v33,36.88
  Bottom 0.152: v20.88,103.88 13.88,103.88 11.12,106.62 R1.1 | v33,36.88 34.62,35.25 37.5,35.25 38.38,34.38 JP14.1
LED_X_DV  (via drill 0.3)
  Top 0.152: v19,95.12 15,91.12 15,85.75 10.25,81 10.25,64.5 10.62,64.12 v10.62,58.38
  Bottom 0.152: v19,95.12 27.75,103.88 35.75,103.88 38.5,106.62 R5.1 | v10.62,58.38 10.38,58.62 5.38,58.62 5,59 1.88,59 1.38,58.5 JP16.1
MORPH_IN  (via drill 0.3)
  Top 0.152: v22.88,71.5 22.38,71 v22.38,50.5
  Bottom 0.152: C53.1 1.75,46.38 5,46.38 J1.P3 5,46.25 5.5,45.75 12.25,45.75 13.75,47.25 16.12,47.25 16.38,47.5 18.62,47.5 21.5,50.38 22.25,50.38 v22.38,50.5 | v22.88,71.5 26.88,71.5 30.12,74.75 47.62,74.75 48.62,73.75 JP2.1
MORPH_IN1  (via drill 0.3)
  Top 0.152: v26.62,75.75 28.25,74.12 28.25,68.38 28.12,68.25 28.12,65 28.38,64.75 v28.38,46.38
  Bottom 0.152: C55.1 34.75,46.38 31.75,46.38 J7.P3 31.62,46.38 v28.38,46.38 | v26.62,75.75 22.12,75.75 21.5,76.38 6.25,76.38 1.38,81.25 JP4.1
MORPH_IN3  (via drill 0.3)
  Top 0.152: v37.5,76.62 32.88,72 32.88,67.12 34,66 34,24 v33.75,23.75 | v19.88,23.75 18.38,25.25 18.38,26 J4.P3
  Bottom 0.152: C56.1 15,27.25 16.12,26.12 18.25,26.12 J4.P3 | v37.5,76.62 44,76.62 48.62,81.25 JP32.1 | v33.75,23.75 33.5,24 20.12,24 v19.88,23.75
MORPH_IN4  (via drill 0.3)
  Top 0.152: v14,28.12 14,28 11.25,28 8.62,30.62 8.62,32 5,32 3.5,33.5 3.5,48.88 6.12,51.5 6.12,57.88 5.25,58.75 5.25,67.62 2.62,70.25 2.62,77.38 1.38,78.62 JP33.1
  Bottom 0.152: J8.P3 31.62,26.12 29.38,26.12 28.38,27.12 C57.1 28.25,27.12 26.62,25.5 24.5,25.5 21.88,28.12 v14,28.12
MORPH_IN5  (via drill 0.3)
  Top 0.152: v35.12,85.62 39.75,81 39.75,52.38 39.62,52.25 39.62,50.75 40,50.38 40,23.88 38.75,22.62 v38.75,11.5
  Bottom 0.152: J6.P3 44.88,2 44.88,3.5 37.88,10.5 C54.1 37.88,10.62 v38.75,11.5 | v35.12,85.62 3.12,85.62 1.38,83.88 JP34.1
MORPH_IN6  (via drill 0.3)
  Top 0.152: v24.88,81.62 19.25,76 19.25,63.75 21.75,61.25 v21.75,49.75
  Bottom 0.152: C58.1 15.5,46.38 18.25,46.38 J5.P3 18.38,46.38 v21.75,49.75 | v24.88,81.62 29.75,81.62 33,84.88 47.62,84.88 48.62,83.88 JP35.1
MORPH_IN7  (via drill 0.3)
  Top 0.152: v21.12,75.75 23.5,73.38 23.5,50.75 v23.25,50.5
  Bottom 0.152: J2.P3 44.88,46.38 42,46.38 C45.1 41.88,46.38 41.25,45.75 37.88,45.75 36.38,47.25 34.25,47.25 33.25,48.25 25.5,48.25 v23.25,50.5 | v21.12,75.75 1.75,75.75 1.38,76.12 JP36.1
N$1
  Bottom 0.152: SW1.A 3.12,101.62 0.38,101.62 0.38,103 1.5,104.12 6.75,104.12 9.25,106.62 R1.2
N$2
  Bottom 0.152: SW2.A 44.75,103.75 43.12,103.75 40.25,106.62 R5.2
N$3  (via drill 0.3)
  Top 0.152: v31,70.12 31.38,69.75 31.38,47.75 30.12,46.5 v30.12,36.12
  Bottom 0.152: IC10.11 16.12,68.75 16.12,71 16.88,71 C49.2 17,71 17.88,70.12 v31,70.12 | v30.12,36.12 31.38,34.88 35.25,34.88 38.38,31.75 JP55.1
N$4
  Bottom 0.152: R26.2 2.12,29.12 2.12,40.38 11,40.38 11.25,40.62 14.12,40.62 14.38,40.38 23.5,40.38 25,41.88 JP37.1
N$5
  Bottom 0.152: R27.2 41.75,27.88 41.75,36.75 38.5,36.75 JP38.1
N$6
  Bottom 0.152: LED13.1 2.5,19.12 7.25,23.88 7.25,28.25 9.12,28.25 11.38,30.5 13.38,30.5 17.75,34.88 24.5,34.88 25,34.38 JP40.1
N$7  (via drill 0.3)
  Top 0.152: v22.38,23.38 23.38,24.38 23.38,30.12 JP41.1
  Bottom 0.152: v22.38,23.38 20,21 17.88,21 16.62,22.25 9,22.25 J10.P3
N$8  (via drill 0.3)
  Top 0.152: v35,23.12 35.88,24 35.88,42.38 37.12,43.62 37.12,45.62 38.38,46.88 JP45.1
  Bottom 0.152: v35,23.12 32.62,23.12 31.75,22.25 J12.P3
N$9  (via drill 0.3)
  Top 0.152: v30.75,66.12 30.5,66.38 30.5,68.5 LED3.3
  Bottom 0.152: v30.75,66.12 33.38,66.12 R19.2
N$10
  Bottom 0.152: R7.2 5.62,16.75 5.5,16.62 2.5,16.62 LED13.2
N$11  (via drill 0.3)
  Top 0.152: v36.5,24.12 38.38,26 38.38,26.62 JP43.1
  Bottom 0.152: v36.5,24.12 36.25,24.38 18.38,24.38 18.38,22.25 J11.P3
N$12
  Bottom 0.152: R18.2 33.38,68.62 33.38,73.62 30.5,73.62 LED3.1
N$13
  Top 0.152: J16.P3 31.62,2 26,7.62 26,18 21.75,22.25 21.75,40.38 24.62,43.25 26.25,43.25 26.25,45.62 25,46.88 JP51.1
N$14
  Bottom 0.152: R8.2 28.25,20 28,20.25 25,20.25 LED6.2
N$15  (via drill 0.3)
  Top 0.152: v25.12,11.62 25,11.75 LED7.2
  Bottom 0.152: v25.12,11.62 25.75,11.62 25.75,10.75 R22.2
N$16
  Bottom 0.152: R9.2 19,91.25 17.12,93.12 16.12,93.12 15.62,93.62 15.62,94.88 18.12,94.88 19,94 LED1.3
N$18
  Bottom 0.152: R11.2 38.5,94.62 37.88,94 35.62,94 LED2.3
N$19  (via drill 0.3)
  Top 0.152: v15.25,20 11.75,23.5 JP44.1
  Bottom 0.152: v15.25,20 21.62,20 25,16.62 LED7.1
N$20
  Bottom 0.152: LED2.1 31.38,94.88 33.88,94.88 33.88,93.62 33.38,93.12 32.5,93.12 30.62,91.25 R12.2
N$21
  Bottom 0.152: R15.2 28.5,49.12 30.12,50.75 30.38,50.75 LED4.3
N$22
  Bottom 0.152: R10.2 11.5,94.62 12.12,94 13.88,94 LED1.1
N$23
  Bottom 0.152: R17.2 33.38,60.88 33.38,56 30.5,56 LED4.1
N$24  (via drill 0.3)
  Top 0.152: v17,59.5 17.12,59.38 17.12,45.25 19.88,42.5 v19.88,31.88
  Bottom 0.152: IC10.4 16.12,63.12 16.12,60.62 16.38,60.62 C48.1 16.5,60.5 16.5,59.5 v17,59.5 | v19.88,31.88 25,26.75 JP54.1
N$36
  Bottom 0.152: R27.1 41.88,26.12 44.88,26.12 J9.P3
N$42
  Bottom 0.152: R36.2 33.38,63.5 32.12,64.75 30.5,64.75 LED5.1
N$43
  Bottom 0.152: JP23.1 R36.1
N$45
  Bottom 0.152: IC10.5 15.25,63.25 15.25,64.38 3,64.38 1.38,66 JP53.1
N$46
  Bottom 0.152: R77.2 47.88,29.5 47.88,33.62 45,33.62 J9.P2
N$47
  Bottom 0.152: R76.2 8.12,29.12 8.12,33.62 5,33.62 J3.P2
N$49
  Top 0.152: J15.P3 18.25,2 17.5,2 15.25,4.25 3.38,4.25 3.38,33.12 2.62,33.88 2.62,61.75 4.25,63.38 4.25,68.12 1.38,71 JP49.1
N$53
  Bottom 0.152: J13.P3 41,22.25 41.75,23 48.5,23 48.75,23.25 48.75,40.38 39.12,40.38 38.88,40.62 32.38,40.62 31.62,39.88 25.5,39.88 JP47.1
N$55
  Bottom 0.152: R19.1 35.12,66 35.12,64.38 34.62,64.38 34.38,64.12 34.38,62 47.62,62 48.62,61 JP24.1
N$57
  Bottom 0.152: R26.1 2.12,27.25 3.25,26.12 5,26.12 J3.P3
N$63
  Top 0.152: JP56.1 47.5,75 47.5,71.75 45.88,70.12 45.88,60.75 47.38,59.25 47.38,30.75 39.5,22.88 39.5,0.38 18.25,0.38 17.12,1.5 17.12,1.88 5,1.88 J14.P3
N$66  (via drill 0.3)
  Top 0.152: v46.5,67 47.5,66 47.5,59.62 48.62,58.5 JP25.1
  Bottom 0.152: v46.5,67 36.75,67 35.25,68.5 R18.1
N$67  (via drill 0.3)
  Top 0.152: v14.75,59.88 15.25,59.38 v15.25,21.62
  Bottom 0.152: v14.75,59.88 14.75,63.12 IC10.6 | v15.25,21.62 16.5,20.38 23.62,20.38 24.88,19.12 31.12,19.12 31.25,19.25 42.12,19.25 44.88,16.5 R78.1 45,16.5 LED9.2
N$68  (via drill 0.3)
  Top 0.152: v26,58.5 25.75,58.25 25.75,55.12 26.25,54.62 26.25,52.12 25.75,51.62 25.75,48.5 27.75,46.5 v27.75,23.38
  Bottom 0.152: v26,58.5 17,58.5 16.25,59.25 14.12,59.25 14.12,63.12 IC10.7 | v27.75,23.38 31.5,19.62 47.25,19.62 47.75,19.12 LED9.1
N$69  (via drill 0.3)
  Top 0.152: v30.25,86.38 38.12,78.5 38.12,76.25 35,73.12 35,64.5 v38.12,61.38
  Bottom 0.152: v30.25,86.38 25.62,86.38 20.88,91.12 R9.1 | v38.12,61.38 44.12,55.38 48.12,55.38 48.62,55.88 JP26.1
N$70  (via drill 0.3)
  Top 0.152: v17.75,62.12 17.88,62.25 17.88,70.25 v15.25,72.88
  Bottom 0.152: v17.75,62.12 16.75,62.12 16.75,63.12 IC10.3 | v15.25,72.88 14,74.12 1.75,74.12 1.38,73.75 JP48.1
N$71  (via drill 0.3)
  Top 0.152: v15.88,64.25 15.62,64 15.62,22.12 15.88,21.88 15.88,9.38 11.75,5.25 LED10.2
  Bottom 0.152: v15.88,64.25 17.25,64.25 17.25,63.25 IC10.2 | R79.1 12.38,2 12.38,5.12 11.75,5.12 LED10.2
N$72  (via drill 0.3)
  Top 0.152: v17.25,61.5 17.88,60.88 17.88,48.5 20.5,45.88 v20.5,10
  Bottom 0.152: v17.25,61.5 18.38,61.5 18.38,62.38 18,62.75 18,63.12 IC10.1 | v20.5,10 18.38,7.88 11.88,7.88 11.75,7.75 LED10.1
N$73  (via drill 0.3)
  Top 0.152: v18.62,69.38 18.5,69.25 v18.5,53.5
  Bottom 0.152: v18.62,69.38 16.75,69.38 16.75,68.75 IC10.12 | v18.5,53.5 16.25,51.25 1.75,51.25 1.38,50.88 JP46.1
N$74  (via drill 0.3)
  Top 0.152: v17.25,67.25 16.88,66.88 16.88,62 16.38,61.5 16.38,25.88 19.88,22.38 v19.88,19.25 | v24,15.12 24,6.25 25,5.25 LED11.2
  Bottom 0.152: v17.25,67.25 17.25,68.62 IC10.13 | v24,15.12 v19.88,19.25 | R80.1 26.25,5.12 25,5.12 LED11.2
N$75  (via drill 0.3)
  Top 0.152: v33.5,67.38 34.38,66.5 v34.38,10.62
  Bottom 0.152: v33.5,67.38 19.25,67.38 18,68.62 IC10.14 | v34.38,10.62 31.62,7.88 25.12,7.88 25,7.75 LED11.1
N$76  (via drill 0.3)
  Top 0.152: v19.25,62.88 19.25,49.75 24.5,44.5 25,44.5 JP50.1
  Bottom 0.152: v19.25,62.88 17.25,64.88 13.62,64.88 13.62,69.25 13.75,69.38 15.25,69.38 15.25,68.75 IC10.10
N$77  (via drill 0.3)
  Top 0.152: v14.75,67.25 16.5,65.5 16.5,62.12 16,61.62 16,22.25 19.88,18.38 19.88,9 28.12,0.75 38.38,0.75 38.38,5.12 LED12.2
  Bottom 0.152: v14.75,67.25 14.75,68.62 IC10.9 | R81.1 39.12,2 39.12,5.12 38.5,5.12 LED12.2
N$78  (via drill 0.3)
  Top 0.152: v32.38,66.75 33.62,65.5 33.62,24.5 33.12,24 33.12,10.25 35.62,7.75 38.38,7.75 LED12.1
  Bottom 0.152: v32.38,66.75 30.5,66.75 30.38,66.62 14.12,66.62 14.12,68.62 IC10.8
N$79  (via drill 0.3)
  Top 0.152: v23.88,86.38 26,84.25 26,74.12 25.38,73.5 25.38,54.62 v25.62,54.38
  Bottom 0.152: v23.88,86.38 18.12,86.38 11.5,93 R10.1 | v25.62,54.38 47.62,54.38 48.62,53.38 JP27.1
N$80  (via drill 0.3)
  Top 0.152: v43.62,88 43.88,87.75 43.88,86 47.5,82.38 47.5,79.88 48.62,78.75 JP28.1
  Bottom 0.152: v43.62,88 38.62,93 R11.1
N$81  (via drill 0.3)
  Top 0.152: v34.88,88.5 35,88.38 35,86.62 40.12,81.5 40.12,68 42.62,65.5 42.62,52 v43.12,51.5
  Bottom 0.152: v34.88,88.5 32.25,91.12 R12.1 | v43.12,51.5 43.38,51.25 48.25,51.25 JP29.1
N$82
  Bottom 0.152: R15.1 28.38,47.38 27.75,46.75 27.75,44.5 38.38,44.5 JP30.1
N$83  (via drill 0.3)
  Top 0.152: v35.12,58.25 35,58.12 v35,43.88
  Bottom 0.152: v35.12,58.25 35.12,60.88 R17.1 | v35,43.88 36.88,42 38.38,42 JP31.1
NORMALIZATION_PROBE  (via drill 0.3)
  Top 0.152: v27,25 27,34.75 25,36.75 JP39.1
  Bottom 0.152: 47.12,24.75 27,24.75 | 27,24.75 10.75,24.75 8.25,27.25 R76.1 | 47.12,24.75 47.88,24 D3.3 | 47.12,24.75 47.88,24.75 47.88,27.62 R77.1 | 27,24.75 v27,25
SW_T_DV  (via drill 0.3)
  Top 0.152: SW1.2 6.62,107.62 6.62,102.75 SW1.1 6.62,102.62 7.38,101.88 7.38,55.5 v7.25,55.38
  Bottom 0.152: v7.25,55.38 1.88,55.38 1.38,55.88 JP15.1
SW_T_MODE  (via drill 0.3)
  Top 0.152: v46.88,74.12 44.75,76.25 44.75,84.62 42,87.38 42,98.5 36,104.5 14.5,104.5 14.5,99.38 15.75,98.12 SW3.4
  Bottom 0.152: SW3.3 9.25,98.12 15.75,98.12 SW3.4 | v46.88,74.12 47.38,74.12 47.38,72.38 48.62,71.12 JP20.1
SW_T_RANGE  (via drill 0.3)
  Top 0.152: v30.25,32.5 29,33.75 v29,68
  Bottom 0.152: SW5.3 20.5,68.88 26.88,68.88 SW5.4 27,68.75 28.25,68.75 v29,68 | v30.25,32.5 35.12,32.5 38.38,29.25 JP19.1
SW_X_DV  (via drill 0.3)
  Top 0.152: SW2.2 48.62,107.62 48.62,102.75 SW2.1 48.5,102.62 48.5,101.5 43.12,101.5 42.38,102.25 42.38,104.88 14.38,104.88 14.12,104.62 14.12,101.25 9.88,97 9.88,69 v8.38,67.5 | v3.62,65 3.62,63.25 1.38,61 JP17.1
  Bottom 0.152: v3.62,65 6.12,67.5 v8.38,67.5
SW_X_EXT
  Bottom 0.152: JP18.1 1.38,63.5 5.88,59 13.88,59 15,57.88 27.38,57.88 31.38,61.88 31.38,63.88 27.5,63.88 27,64.38 SW7.3 26.88,64.5 20.5,64.5 SW7.4
SW_X_MODE  (via drill 0.3)
  Top 0.152: SW4.3 34.25,98.12 40.75,98.12 SW4.4 40.88,98 40.88,88 42.25,86.62 42.25,71.5 v43.12,70.62
  Bottom 0.152: v43.12,70.62 46.62,70.62 48.62,68.62 JP21.1
SW_X_RANGE  (via drill 0.3)
  Top 0.152: v41.62,64.12 40.25,62.75 v40.25,52
  Bottom 0.152: SW6.3 20.5,51.12 26.88,51.12 SW6.4 27,51.12 27.62,51.75 40,51.75 v40.25,52 | v41.62,64.12 46.75,64.12 48.62,66 JP22.1

### Text on the board
_tNames: SW3 | SW4 | LED1 | LED2 | SW5 | LED3 | SW7 | LED5 | SW6 | LED4 | J1 | J5 | J7 | J2 | J3 | J4 | J8 | J9 | J10 | J11 | J12 | J13 | LED13 | LED6 | LED9 | LED7 | J14 | J15 | J16 | J6 | LED10 | LED11 | LED12
_bNames: R1 | R5 | R10 | R11 | R9 | C8 | R12 | C17 | C18 | C24 | C49 | C38 | R18 | C36 | IC10 | R19 | R36 | C48 | R17 | C28 | C29 | R15 | C53 | C58 | C55 | C45 | R77 | R26 | R76 | C56 | C57 | R27 | D3 | R8 | R7 | R78 | R22 | C54 | R79 | R80 | R81